# Altium schematic sheet regulator_interposer.SchDoc
size A
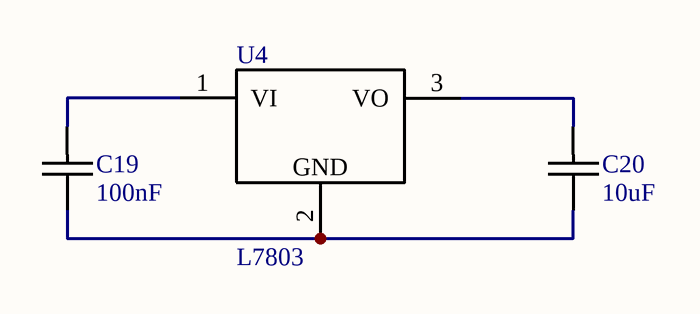
[diagram p0: regulator_interposer.SchDoc]

## Parts
C19  100nF  [0603C-GENERIC]
C20  10uF  [CAPC6032X25N]
U4  L7803  [to220-123-v]

## Nets
NetC19_1: C19.1 U4.1(VI)
NetC19_2: C19.2 C20.2 U4.2
NetC20_1: C20.1 U4.3(VO)

## Notes on the sheet
- (in symbol L7805-TO220) GND

## Library data of the parts
C19 = 0603C-100NF-25V-X7R-TDK: CAPACITOR 0603 CERAMIC; Manufacturer Part Number: C1608X7R1E104K; Manufacturer: TDK Corporation; Reel: C12; Supplier 1: Digi-Key; Supplier Part Number 1: 445-1316-2-ND
C20 = 0603C-10UF-10V-X5R-TDK: CAPACITOR 2413 TANT; Manufacturer Part Number: T491C106K016AT; Manufacturer: Kemet; Reel: C31; Supplier 1: Digi-Key; Supplier Part Number 1: 399-3732-1-ND
U4 = L7805-TO220: LINEAR REGULATOR 5.0V; Supplier 1: Mouser; Supplier Part Number 1: 511-L7805ACP